# Altium schematic sheet ADC.SchDoc: Eval Board -  Analog differential inputs
size A2; Author: O. Guinnard; Organization: imperix Ltd; Address1: Rue de l'Industrie 10; Address2: 1950 Sion; Address3: Switzerland; Address4: +41 27 552 06 60; DocumentNumber: 3; SheetNumber: 3; SheetTotal: 7
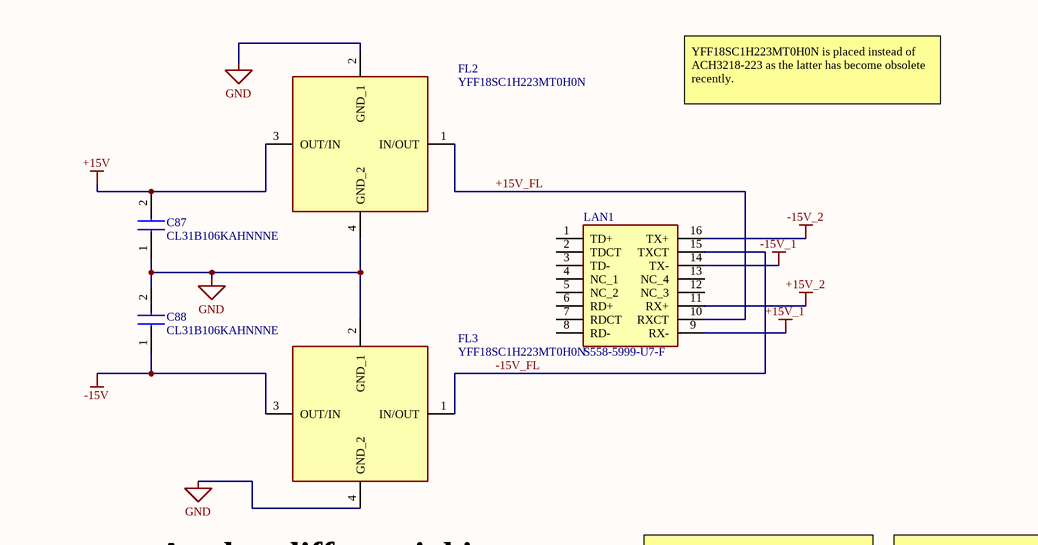
[diagram p0: ADC.SchDoc, top left]
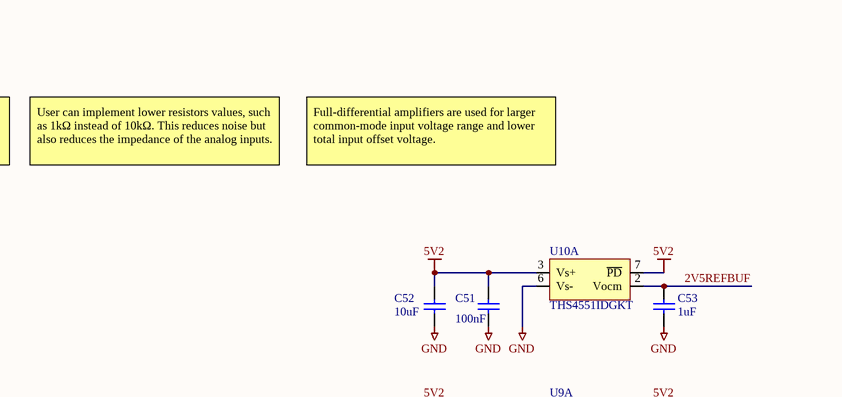
[diagram p1: ADC.SchDoc, top right]
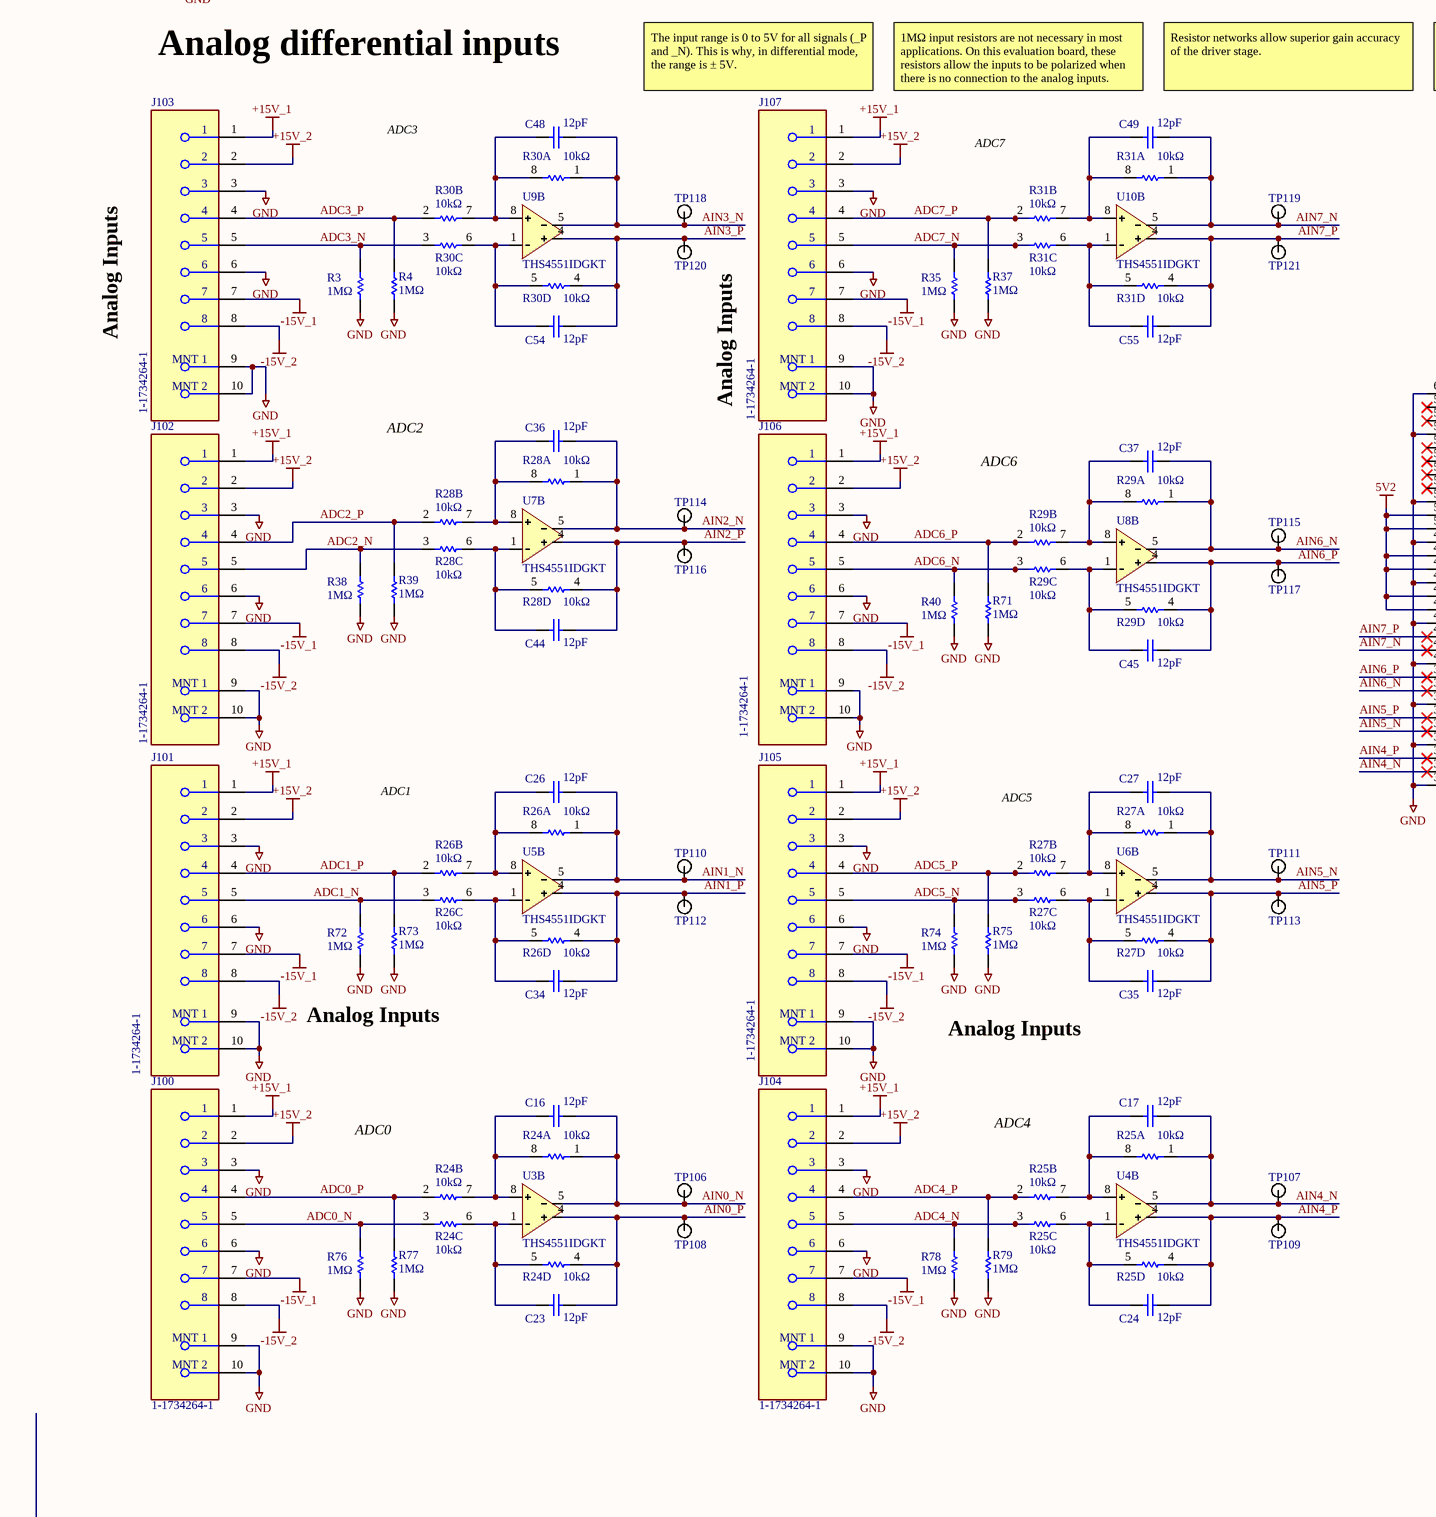
[diagram p2: ADC.SchDoc, bottom left]
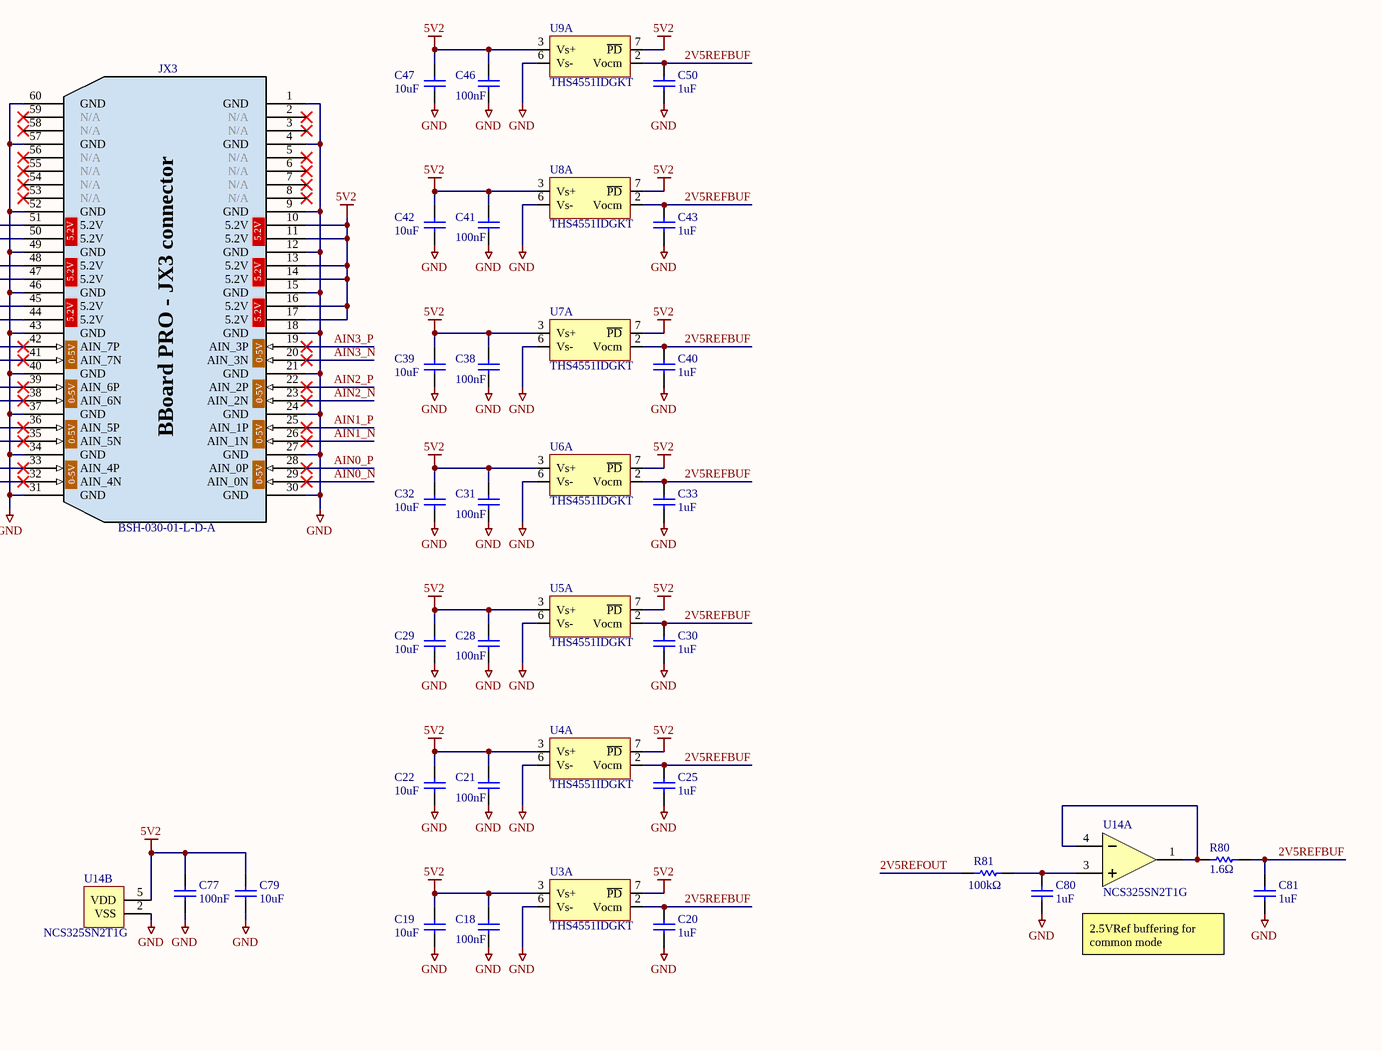
[diagram p3: ADC.SchDoc, bottom right]

## Parts
C16  value 12pF  [CAPC1005L(0402)]  (hidden comment: CAP-12PF-50V-C0G-0402-5%)
C17  value 12pF  [CAPC1005L(0402)]  (hidden comment: CAP-12PF-50V-C0G-0402-5%)
C18  value 100nF  [CAPC1005L(0402)]  (hidden comment: CAP-100NF-25V-X7R-0402-10%)
C19  value 10uF  [CAPC1608L(0603)]  (hidden comment: CAP-10UF-10V-X5R-0603-10%)
C20  value 1uF  [CAPC1005L(0402)]  (hidden comment: CAP-1UF-6.3V-X5R-0402-5%)
C21  value 100nF  [CAPC1005L(0402)]  (hidden comment: CAP-100NF-25V-X7R-0402-10%)
C22  value 10uF  [CAPC1608L(0603)]  (hidden comment: CAP-10UF-10V-X5R-0603-10%)
C23  value 12pF  [CAPC1005L(0402)]  (hidden comment: CAP-12PF-50V-C0G-0402-5%)
C24  value 12pF  [CAPC1005L(0402)]  (hidden comment: CAP-12PF-50V-C0G-0402-5%)
C25  value 1uF  [CAPC1005L(0402)]  (hidden comment: CAP-1UF-6.3V-X5R-0402-5%)
C26  value 12pF  [CAPC1005L(0402)]  (hidden comment: CAP-12PF-50V-C0G-0402-5%)
C27  value 12pF  [CAPC1005L(0402)]  (hidden comment: CAP-12PF-50V-C0G-0402-5%)
C28  value 100nF  [CAPC1005L(0402)]  (hidden comment: CAP-100NF-25V-X7R-0402-10%)
C29  value 10uF  [CAPC1608L(0603)]  (hidden comment: CAP-10UF-10V-X5R-0603-10%)
C30  value 1uF  [CAPC1005L(0402)]  (hidden comment: CAP-1UF-6.3V-X5R-0402-5%)
C31  value 100nF  [CAPC1005L(0402)]  (hidden comment: CAP-100NF-25V-X7R-0402-10%)
C32  value 10uF  [CAPC1608L(0603)]  (hidden comment: CAP-10UF-10V-X5R-0603-10%)
C33  value 1uF  [CAPC1005L(0402)]  (hidden comment: CAP-1UF-6.3V-X5R-0402-5%)
C34  value 12pF  [CAPC1005L(0402)]  (hidden comment: CAP-12PF-50V-C0G-0402-5%)
C35  value 12pF  [CAPC1005L(0402)]  (hidden comment: CAP-12PF-50V-C0G-0402-5%)
C36  value 12pF  [CAPC1005L(0402)]  (hidden comment: CAP-12PF-50V-C0G-0402-5%)
C37  value 12pF  [CAPC1005L(0402)]  (hidden comment: CAP-12PF-50V-C0G-0402-5%)
C38  value 100nF  [CAPC1005L(0402)]  (hidden comment: CAP-100NF-25V-X7R-0402-10%)
C39  value 10uF  [CAPC1608L(0603)]  (hidden comment: CAP-10UF-10V-X5R-0603-10%)
C40  value 1uF  [CAPC1005L(0402)]  (hidden comment: CAP-1UF-6.3V-X5R-0402-5%)
C41  value 100nF  [CAPC1005L(0402)]  (hidden comment: CAP-100NF-25V-X7R-0402-10%)
C42  value 10uF  [CAPC1608L(0603)]  (hidden comment: CAP-10UF-10V-X5R-0603-10%)
C43  value 1uF  [CAPC1005L(0402)]  (hidden comment: CAP-1UF-6.3V-X5R-0402-5%)
C44  value 12pF  [CAPC1005L(0402)]  (hidden comment: CAP-12PF-50V-C0G-0402-5%)
C45  value 12pF  [CAPC1005L(0402)]  (hidden comment: CAP-12PF-50V-C0G-0402-5%)
C46  value 100nF  [CAPC1005L(0402)]  (hidden comment: CAP-100NF-25V-X7R-0402-10%)
C47  value 10uF  [CAPC1608L(0603)]  (hidden comment: CAP-10UF-10V-X5R-0603-10%)
C48  value 12pF  [CAPC1005L(0402)]  (hidden comment: CAP-12PF-50V-C0G-0402-5%)
C49  value 12pF  [CAPC1005L(0402)]  (hidden comment: CAP-12PF-50V-C0G-0402-5%)
C50  value 1uF  [CAPC1005L(0402)]  (hidden comment: CAP-1UF-6.3V-X5R-0402-5%)
C51  value 100nF  [CAPC1005L(0402)]  (hidden comment: CAP-100NF-25V-X7R-0402-10%)
C52  value 10uF  [CAPC1608L(0603)]  (hidden comment: CAP-10UF-10V-X5R-0603-10%)
C53  value 1uF  [CAPC1005L(0402)]  (hidden comment: CAP-1UF-6.3V-X5R-0402-5%)
C54  value 12pF  [CAPC1005L(0402)]  (hidden comment: CAP-12PF-50V-C0G-0402-5%)
C55  value 12pF  [CAPC1005L(0402)]  (hidden comment: CAP-12PF-50V-C0G-0402-5%)
C77  value 100nF  [CAPC1005L(0402)]  (hidden comment: CAP-100NF-25V-X7R-0402-10%)
C79  value 10uF  [CAPC1608L(0603)]  (hidden comment: CAP-10UF-10V-X5R-0603-10%)
C80  value 1uF  [CAPC1005L(0402)]  (hidden comment: CAP-1UF-6.3V-X5R-0402-5%)
C81  value 1uF  [CAPC1005L(0402)]  (hidden comment: CAP-1UF-6.3V-X5R-0402-5%)
C87  CL31B106KAHNNNE  [CAPC3216X180N]
C88  CL31B106KAHNNNE  [CAPC3216X180N]
FL2  YFF18SC1H223MT0H0N  [YFF18SC1H223MT0H0N]
FL3  YFF18SC1H223MT0H0N  [YFF18SC1H223MT0H0N]
J100  1-1734264-1  [FP-1-1734264-1-MFG]
J101  1-1734264-1  [FP-1-1734264-1-MFG]
J102  1-1734264-1  [FP-1-1734264-1-MFG]
J103  1-1734264-1  [FP-1-1734264-1-MFG]
J104  1-1734264-1  [FP-1-1734264-1-MFG]
J105  1-1734264-1  [FP-1-1734264-1-MFG]
J106  1-1734264-1  [FP-1-1734264-1-MFG]
J107  1-1734264-1  [FP-1-1734264-1-MFG]
JX3  BSH-030-01-L-D-A  [BSH-030-01-L-D-A]
LAN1  S558-5999-U7-F  [SOIC127P920X571-16N]
R3  value 1MΩ  [RESC1005L(0402)]  (hidden comment: RES-1MΩ-1/16W-100PPM-0402-1%)
R4  value 1MΩ  [RESC1005L(0402)]  (hidden comment: RES-1MΩ-1/16W-100PPM-0402-1%)
R24  value 10kΩ  [RESQUAD1206]  (hidden comment: ACASA1002S1002P100)  (parts A,B,C,D of 4)
R25  value 10kΩ  [RESQUAD1206]  (hidden comment: ACASA1002S1002P100)  (parts A,B,C,D of 4)
R26  value 10kΩ  [RESQUAD1206]  (hidden comment: ACASA1002S1002P100)  (parts A,B,C,D of 4)
R27  value 10kΩ  [RESQUAD1206]  (hidden comment: ACASA1002S1002P100)  (parts A,B,C,D of 4)
R28  value 10kΩ  [RESQUAD1206]  (hidden comment: ACASA1002S1002P100)  (parts A,B,C,D of 4)
R29  value 10kΩ  [RESQUAD1206]  (hidden comment: ACASA1002S1002P100)  (parts A,B,C,D of 4)
R30  value 10kΩ  [RESQUAD1206]  (hidden comment: ACASA1002S1002P100)  (parts A,B,C,D of 4)
R31  value 10kΩ  [RESQUAD1206]  (hidden comment: ACASA1002S1002P100)  (parts A,B,C,D of 4)
R35  value 1MΩ  [RESC1005L(0402)]  (hidden comment: RES-1MΩ-1/16W-100PPM-0402-1%)
R37  value 1MΩ  [RESC1005L(0402)]  (hidden comment: RES-1MΩ-1/16W-100PPM-0402-1%)
R38  value 1MΩ  [RESC1005L(0402)]  (hidden comment: RES-1MΩ-1/16W-100PPM-0402-1%)
R39  value 1MΩ  [RESC1005L(0402)]  (hidden comment: RES-1MΩ-1/16W-100PPM-0402-1%)
R40  value 1MΩ  [RESC1005L(0402)]  (hidden comment: RES-1MΩ-1/16W-100PPM-0402-1%)
R71  value 1MΩ  [RESC1005L(0402)]  (hidden comment: RES-1MΩ-1/16W-100PPM-0402-1%)
R72  value 1MΩ  [RESC1005L(0402)]  (hidden comment: RES-1MΩ-1/16W-100PPM-0402-1%)
R73  value 1MΩ  [RESC1005L(0402)]  (hidden comment: RES-1MΩ-1/16W-100PPM-0402-1%)
R74  value 1MΩ  [RESC1005L(0402)]  (hidden comment: RES-1MΩ-1/16W-100PPM-0402-1%)
R75  value 1MΩ  [RESC1005L(0402)]  (hidden comment: RES-1MΩ-1/16W-100PPM-0402-1%)
R76  value 1MΩ  [RESC1005L(0402)]  (hidden comment: RES-1MΩ-1/16W-100PPM-0402-1%)
R77  value 1MΩ  [RESC1005L(0402)]  (hidden comment: RES-1MΩ-1/16W-100PPM-0402-1%)
R78  value 1MΩ  [RESC1005L(0402)]  (hidden comment: RES-1MΩ-1/16W-100PPM-0402-1%)
R79  value 1MΩ  [RESC1005L(0402)]  (hidden comment: RES-1MΩ-1/16W-100PPM-0402-1%)
R80  value 1.6Ω  [RESC1005L(0402)]  (hidden comment: RES-1.6Ω-1/16WW-200PPM-0402-5%)
R81  value 100kΩ  [RESC1005L(0402)]  (hidden comment: RES-100KΩ-1/16W-100PPM-0402-1%)
TP106  5001  [5001]  (value not drawn)
TP107  5001  [5001]  (value not drawn)
TP108  5001  [5001]  (value not drawn)
TP109  5001  [5001]  (value not drawn)
TP110  5001  [5001]  (value not drawn)
TP111  5001  [5001]  (value not drawn)
TP112  5001  [5001]  (value not drawn)
TP113  5001  [5001]  (value not drawn)
TP114  5001  [5001]  (value not drawn)
TP115  5001  [5001]  (value not drawn)
TP116  5001  [5001]  (value not drawn)
TP117  5001  [5001]  (value not drawn)
TP118  5001  [5001]  (value not drawn)
TP119  5001  [5001]  (value not drawn)
TP120  5001  [5001]  (value not drawn)
TP121  5001  [5001]  (value not drawn)
U3  THS4551IDGKT  [TSOP65P490-8AL]  (parts A,B of 2)
U4  THS4551IDGKT  [TSOP65P490-8AL]  (parts A,B of 2)
U5  THS4551IDGKT  [TSOP65P490-8AL]  (parts A,B of 2)
U6  THS4551IDGKT  [TSOP65P490-8AL]  (parts A,B of 2)
U7  THS4551IDGKT  [TSOP65P490-8AL]  (parts A,B of 2)
U8  THS4551IDGKT  [TSOP65P490-8AL]  (parts A,B of 2)
U9  THS4551IDGKT  [TSOP65P490-8AL]  (parts A,B of 2)
U10  THS4551IDGKT  [TSOP65P490-8AL]  (parts A,B of 2)
U14  NCS325SN2T1G  [SOT23-5AL]  (parts A,B of 2)

## Nets
5V2: C18.2 C19.2 C21.2 C22.2 C28.2 C29.2 C31.2 C32.2 C38.2 C39.2 C41.2 C42.2 C46.2 C47.2 C51.2 C52.2 C77.2 C79.2 JX3.10(5.2V) JX3.11(5.2V) JX3.13(5.2V) JX3.14(5.2V) JX3.16(5.2V) JX3.17(5.2V) JX3.44(5.2V) JX3.45(5.2V) JX3.47(5.2V) JX3.48(5.2V) JX3.50(5.2V) JX3.51(5.2V) U3.3(Vs+) U3.7(~{PD}) U4.3(Vs+) U4.7(~{PD}) U5.3(Vs+) U5.7(~{PD}) U6.3(Vs+) U6.7(~{PD}) U7.3(Vs+) U7.7(~{PD}) U8.3(Vs+) U8.7(~{PD}) U9.3(Vs+) U9.7(~{PD}) U10.3(Vs+) U10.7(~{PD}) U14.5(VDD)
+15V: C87.2 FL2.3(OUT/IN)
+15V_1: J100.1 J101.1 J102.1 J103.1 J104.1 J105.1 J106.1 J107.1 LAN1.9(RX-)
+15V_2: J100.2 J101.2 J102.2 J103.2 J104.2 J105.2 J106.2 J107.2 LAN1.11(RX+)
-15V: C88.1 FL3.3(OUT/IN)
-15V_1: J100.7 J101.7 J102.7 J103.7 J104.7 J105.7 J106.7 J107.7 LAN1.14(TX-)
-15V_2: J100.8 J101.8 J102.8 J103.8 J104.8 J105.8 J106.8 J107.8 LAN1.16(TX+)
GND: C18.1 C19.1 C20.1 C21.1 C22.1 C25.1 C28.1 C29.1 C30.1 C31.1 C32.1 C33.1 C38.1 C39.1 C40.1 C41.1 C42.1 C43.1 C46.1 C47.1 C50.1 C51.1 C52.1 C53.1 C77.1 C79.1 C80.1 C81.1 C87.1 C88.2 FL2.2(GND_1) FL2.4(GND_2) FL3.2(GND_1) FL3.4(GND_2) J100.3 J100.6 J100.9(MNT_1) J100.10(MNT_2) J101.3 J101.6 J101.9(MNT_1) J101.10(MNT_2) J102.3 J102.6 J102.9(MNT_1) J102.10(MNT_2) J103.3 J103.6 J103.9(MNT_1) J103.10(MNT_2) J104.3 J104.6 J104.9(MNT_1) J104.10(MNT_2) J105.3 J105.6 J105.9(MNT_1) J105.10(MNT_2) J106.3 J106.6 J106.9(MNT_1) J106.10(MNT_2) J107.3 J107.6 J107.9(MNT_1) J107.10(MNT_2) JX3.1(GND) JX3.4(GND) JX3.9(GND) JX3.12(GND) JX3.15(GND) JX3.18(GND) JX3.21(GND) JX3.24(GND) JX3.27(GND) JX3.30(GND) JX3.31(GND) JX3.34(GND) JX3.37(GND) JX3.40(GND) JX3.43(GND) JX3.46(GND) JX3.49(GND) JX3.52(GND) JX3.57(GND) JX3.60(GND) R3.1 R4.1 R35.1 R37.1 R38.1 R39.1 R40.1 R71.1 R72.1 R73.1 R74.1 R75.1 R76.1 R77.1 R78.1 R79.1 U3.6(Vs-) U4.6(Vs-) U5.6(Vs-) U6.6(Vs-) U7.6(Vs-) U8.6(Vs-) U9.6(Vs-) U10.6(Vs-) U14.2(VSS)
2V5REFBUF: C20.2 C25.2 C30.2 C33.2 C40.2 C43.2 C50.2 C53.2 C81.2 R80.2 U3.2(Vocm) U4.2(Vocm) U5.2(Vocm) U6.2(Vocm) U7.2(Vocm) U8.2(Vocm) U9.2(Vocm) U10.2(Vocm)
2V5REFOUT: R81.1
+15V_FL: FL2.1(IN/OUT) LAN1.10(RXCT)
-15V_FL: FL3.1(IN/OUT) LAN1.15(TXCT)
ADC0_N: J100.5 R24.3 R76.2
ADC0_P: J100.4 R24.2 R77.2
ADC1_N: J101.5 R26.3 R72.2
ADC1_P: J101.4 R26.2 R73.2
ADC2_N: J102.5 R28.3 R38.2
ADC2_P: J102.4 R28.2 R39.2
ADC3_N: J103.5 R3.2 R30.3
ADC3_P: J103.4 R4.2 R30.2
ADC4_N: J104.5 R25.3 R78.2
ADC4_P: J104.4 R25.2 R79.2
ADC5_N: J105.5 R27.3 R74.2
ADC5_P: J105.4 R27.2 R75.2
ADC6_N: J106.5 R29.3 R40.2
ADC6_P: J106.4 R29.2 R71.2
ADC7_N: J107.5 R31.3 R35.2
ADC7_P: J107.4 R31.2 R37.2
AIN0_N: C16.2 JX3.29(AIN_0N) R24.1 TP106.1(TP) U3.5(-)
AIN0_P: C23.2 JX3.28(AIN_0P) R24.4 TP108.1(TP) U3.4(+)
AIN1_N: C26.2 JX3.26(AIN_1N) R26.1 TP110.1(TP) U5.5(-)
AIN1_P: C34.2 JX3.25(AIN_1P) R26.4 TP112.1(TP) U5.4(+)
AIN2_N: C36.2 JX3.23(AIN_2N) R28.1 TP114.1(TP) U7.5(-)
AIN2_P: C44.2 JX3.22(AIN_2P) R28.4 TP116.1(TP) U7.4(+)
AIN3_N: C48.2 JX3.20(AIN_3N) R30.1 TP118.1(TP) U9.5(-)
AIN3_P: C54.2 JX3.19(AIN_3P) R30.4 TP120.1(TP) U9.4(+)
AIN4_N: C17.2 JX3.32(AIN_4N) R25.1 TP107.1(TP) U4.5(-)
AIN4_P: C24.2 JX3.33(AIN_4P) R25.4 TP109.1(TP) U4.4(+)
AIN5_N: C27.2 JX3.35(AIN_5N) R27.1 TP111.1(TP) U6.5(-)
AIN5_P: C35.2 JX3.36(AIN_5P) R27.4 TP113.1(TP) U6.4(+)
AIN6_N: C37.2 JX3.38(AIN_6N) R29.1 TP115.1(TP) U8.5(-)
AIN6_P: C45.2 JX3.39(AIN_6P) R29.4 TP117.1(TP) U8.4(+)
AIN7_N: C49.2 JX3.41(AIN_7N) R31.1 TP119.1(TP) U10.5(-)
AIN7_P: C55.2 JX3.42(AIN_7P) R31.4 TP121.1(TP) U10.4(+)
NetC16_1: C16.1 R24.7 R24.8 U3.8(+)
NetC17_1: C17.1 R25.7 R25.8 U4.8(+)
NetC23_1: C23.1 R24.5 R24.6 U3.1(-)
NetC24_1: C24.1 R25.5 R25.6 U4.1(-)
NetC26_1: C26.1 R26.7 R26.8 U5.8(+)
NetC27_1: C27.1 R27.7 R27.8 U6.8(+)
NetC34_1: C34.1 R26.5 R26.6 U5.1(-)
NetC35_1: C35.1 R27.5 R27.6 U6.1(-)
NetC36_1: C36.1 R28.7 R28.8 U7.8(+)
NetC37_1: C37.1 R29.7 R29.8 U8.8(+)
NetC44_1: C44.1 R28.5 R28.6 U7.1(-)
NetC45_1: C45.1 R29.5 R29.6 U8.1(-)
NetC48_1: C48.1 R30.7 R30.8 U9.8(+)
NetC49_1: C49.1 R31.7 R31.8 U10.8(+)
NetC54_1: C54.1 R30.5 R30.6 U9.1(-)
NetC55_1: C55.1 R31.5 R31.6 U10.1(-)
NetC80_2: C80.2 R81.2 U14.3(IN+)
NetR80_1: R80.1 U14.1(OUT) U14.4(IN-)

Not connected (* = marked no-connect by the designer): JX3 2(N/A)* 3(N/A)* 5(N/A)* 6(N/A)* 7(N/A)* 8(N/A)* 53(N/A)* 54(N/A)* 55(N/A)* 56(N/A)* 58(N/A)* 59(N/A)*; LAN1 1(TD+) 2(TDCT) 3(TD-) 4(NC_1) 5(NC_2) 6(RD+) 7(RDCT) 8(RD-) 12(NC_3) 13(NC_4)

## Notes on the sheet
- YFF18SC1H223MT0H0N is placed instead of ACH3218-223 as the latter has become obsolete recently.
- Analog differential inputs
- ADC3
- (near J107) The input range is 0 to 5V for all signals (_P and _N). This is why, in differential mode, the range is ± 5V.
- (near C49) 1MΩ input resistors are not necessary in most applications. On this evaluation board, these resistors allow the inputs to be polarized when there is no connection to the analog inputs.
- (near C49) Resistor networks allow superior gain accuracy of the driver stage.
- User can implement lower resistors values, such as 1kΩ instead of 10kΩ. This reduces noise but also reduces the impedance of the analog inputs.
- Full-differential amplifiers are used for larger common-mode input voltage range and lower total input offset voltage.
- ADC7
- Analog Inputs
- (near TP120) Analog Inputs
- ADC2
- ADC6
- ADC1
- ADC5
- ADC0
- ADC4
- 2.5VRef buffering for common mode
- Title:
- Imperix Ltd
- Route des Ronquos 23
- Author:
- Project:
- Size:
- A3
- Date:
- Time:
- Revision:
- Sheet
- of
- 1950 Sion
- Switzerland
- +41 27 552 06 60
- dev@imperix.ch
- Revised by:
- File:
- (in symbol CMP-070-000037-3) 0-5V; BBoard PRO - JX3 connector

## Library data of the parts
C16 C17 C23 C24 C26 C27 C34-C37 C44 C45 C48 C49 C54 C55 = CMP-004-000007-13: CAP CER 12PF 50V C0G 0402 5% (Generic Imperix Component); Tolerance: 5%; Case/Package: 0402; Dielectric: C0G; Voltage Rating (DC): 50V
C18 C21 C28 C31 C38 C41 C46 C51 C77 = CMP-004-000006-18: CAP CER 100NF 25V X7R 0402 10% (Generic Imperix Component); Tolerance: 10%; Case/Package: 0402; Dielectric: X7R; Voltage Rating (DC): 25V
C19 C22 C29 C32 C39 C42 C47 C52 C79 = CMP-055-000003-7: CAP CER 10UF 10V X5R 0603 10% (Generic Imperix Component); Tolerance: 10%; Dielectric: X5R; Voltage Rating (DC): 10V; Case/Package: 0603
C20 C25 C30 C33 C40 C43 C50 C53 C80 C81 = CMP-004-000008-13: CAP CER 1UF 6.3V X5R 0402 5% (Generic Imperix Component); Tolerance: 5%; Case/Package: 0402; Dielectric: X5R; Voltage Rating (DC): 6.3V
C87 C88 = CL31B106KAHNNNE: Capacitor; Manufacturer_Name: SAMSUNG; Datasheet Link: https://datasheet.datasheetarchive.com/originals/distributors/Datasheets_SAMA/d94547340e0e9d2be5f415b64e4e2f0a.pdf; Height: 1.8mm; Manufacturer_Part_Number: CL31B106KAHNNNE; Mouser Part Number: 187-CL31B106KAHNNNE; Mouser Price/Stock: https://www.mouser.co.uk/ProductDetail/Samsung-Electro-Mechanics/CL31B106KAHNNNE?qs=349EhDEZ59r5EZhnLOTsYA%3D%3D; Arrow Part Number: CL31B106KAHNNNE; Arrow Price/Stock: https://www.arrow.com/en/products/cl31b106kahnnne/samsung-electro-mechanics?region=nac
FL2 FL3 = YFF18SC1H223MT0H0N: Filter; Manufacturer_Name: TDK; Datasheet Link: https://product.tdk.com/system/files/dam/doc/product/emc/emc/3tf/catalog/3tf_commercial_signal_yff-sc_en.pdf; Height: 0.85mm; Manufacturer_Part_Number: YFF18SC1H223MT0H0N; Mouser Part Number: 810-YFF18SC1H223MTHN; Mouser Price/Stock: https://www.mouser.co.uk/ProductDetail/TDK/YFF18SC1H223MT0H0N?qs=1gGcJ6gR7Y3FwyPVmpuGww%3D%3D; Arrow Part Number: YFF18SC1H223MT0H0N; Arrow Price/Stock: https://www.arrow.com/en/products/yff18sc1h223mt0h0n/tdk
J100-J107 = CMP-03790-45268370-1: 1-1734264-1 Conn Modular Jack F 8 POS 1.02mm Solder RA Thru-Hole 8 Terminal 1 Port Cat 5 Box/Tray; Manufacturer Lifecycle Status: ACTIVE; Element Configuration: Single; PCB Mounting Orientation: Right Angle; Keyed: No; Number of Positions Loaded: 8; Tail Length: 2.79mm; Shielding: Yes; PCB Thickness: 1.6mm; Circuit Application: Signal; Voltage Rating: 150V; Current Rating: 1A; Lead Free: Lead Free; Contact Plating: Gold; Radiation Hardening: No; Max Operating Temperature: 85°C; RoHS: Compliant; Orientation: Right Angle; Height: 15.5mm; Lifecycle Status: Production; Termination: Solder; Contact Material: Bronze, Gold, Nickel; Min Operating Temperature: -40°C; Number of Contacts: 8; Contact Finish Thickness - Mating: 380nm; Packaging: Box; Color: Black; Housing Material: Thermoplastic; Housing Color: Black; Number of Positions: 8; ELV: Compliant; NexarPartId: 45268370; Flammability Rating: UL94 V-0
JX3 = CMP-070-000037-3: JX3 for BBoard; Number of Contacts: 60; Pitch: 0.5mm; Gender: Female; Mated Stacking Heights: 5mm; Number of Rows: 2; Contact Plating: Gold; Series: BSH; Number of Positions: 60; Radiation Hardening: No; RoHS Compliant: Yes; Termination: Solder; Packaging: Tray
LAN1 = S558-5999-U7-F: Integrated Circuit; Manufacturer_Name: BelFuse; Datasheet Link: https://datasheet.datasheetarchive.com/originals/distributors/Datasheets_SAMA/db0cb1a0bfcf5d4689e4d1da1843e2e3.pdf; Height: 5.71mm; Manufacturer_Part_Number: S558-5999-U7-F; Mouser Part Number: 530-S558-5999-U7-F; Mouser Price/Stock: http://www.mouser.com/Search/ProductDetail.aspx?qs=SRYZG9HaIQ2NmzVD%252bSK3sg%3d%3d; Arrow Part Number: S558-5999-U7-F; Arrow Price/Stock: https://www.arrow.com/en/products/s558-5999-u7-f/bel-group
R3 R4 R35 R37-R40 R71-R79 = CMP-00160-1: RES SMD 1MΩ 1/16W 100PPM 0402 1% (Generic Imperix Component); Temperature Coefficient: 100ppm/°C; Tolerance: 1%; Case/Package: 0402; Power Rating: 1/16W
R24-R31 = CMP-017-000003-7: 10k Ohm ±0.1% 100mW Power Per Element Isolated 4 Resistor Network/Array ±25ppm/°C 1206 (3216 Metric), Convex, Long Side Terminals; Number of Resistors: 4; Tolerance Relative: 0.05%; Tolerance: 0.1%; Case/Package: 1206; Case Code (Imperial): 1206; Case Code (Metric): 3216; Circuit Type: Isolated; Lead Free: Lead Free; Max Operating Temperature: 125°C; Min Operating Temperature: -55°C; Mounting Technology: Surface Mount; Packaging: Cut Tape; Pins: 8; Power Per Element: 100mW; Power Rating: 100mW; RoHS Compliant: Yes; Series: ACA - Precision; Temperature Coefficient: 25ppm/°C
R80 = CMP-004-000018-3: RES SMD 1.6Ω 1/16WW 200PPM 0402 5% (Generic Imperix Component); Temperature Coefficient: 200ppm/°C; Power Rating: 1/16W; Tolerance: 5%; Case/Package: 0402
R81 = CMP-009-000006-6: RES SMD 100KΩ 1/16W 100PPM 0402 1% (Generic Imperix Component); Temperature Coefficient: 100ppm/°C; Case/Package: 0402; Power Rating: 1/16W; Tolerance: 1%
TP106-TP121 = CMP-049-000000-14: Black PC Test Point, Miniature Phosphor Bronze Silver Plating Through Hole Mounting Type; Hole Diameter: 1.6mm; Inside Diameter: 1.27mm; Outside Diameter: 2.54mm; Number of Contacts: 1; Insulation: Insulated; Body Material: Bronze; Color: Black; Contact Material: Bronze; Contact Plating: Tin,Silver; Lead Free: Lead Free; Length: 7.62mm; Material: Nylon,Bronze,Silver; Mounting Technology: Through Hole; Package Quantity: 100; Packaging: Bulk; Reach SVHC Compliant: No; RoHS Compliant: Yes; Series: THM; Insulation Material: Nylon; Housing Color: Black; Orientation: Straight; Diameter: 2.54mm; Termination: Through Hole; Number of Ports: 1; Plating: Silver
U3-U10 = CMP-011-000002-8: Low Noise, Precision, 150MHz, Fully Differential Amplifier 8-TSOP -40 to 125; Bandwidth: 135MHz; Slew Rate: 220V/µs; Operating Supply Current: 1.35mA; Number of Circuits: 1; Input Offset Voltage (Vos): 50uV; Input Bias Current: 1uA; Lead Free: Lead Free; -3db Bandwidth: 150MHz; Series: -; Min Operating Temperature: -40°C; Max Operating Temperature: 125°C; Gain Bandwidth Product: 135MHz; Number of Amplifiers: 1; RoHS Compliant: Yes; Number of Channels: 1; Case/Package: TSOP-8; Packaging: Cut Tape; Pins: 8; Mounting Technology: Surface Mount; Reach SVHC Compliant: No; Amplifier Type: DIFFERENTIAL
U14 = CMP-00165-2: Single Operational Amplifier, 50 µV Offset, 0.25 µV/°C, Zero-Drift Precision, Low Power; Output Current per Channel: 5mA; Input Offset Voltage (Vos): 14uV; Input Bias Current: 50pA; Slew Rate: 0.16V/µs; Gain Bandwidth Product: 350kHz; Operating Supply Current: 21uA; Number of Circuits: 1; RoHS Compliant: Yes; Series: -; Case/Package: SOT-23-5; Packaging: Tape and Reel; Max Operating Temperature: 125°C; Mounting Technology: Surface Mount; Min Operating Temperature: -40°C; Lead Free: Lead Free